# EAGLE design g030f6 (EAGLE 9.6.2)
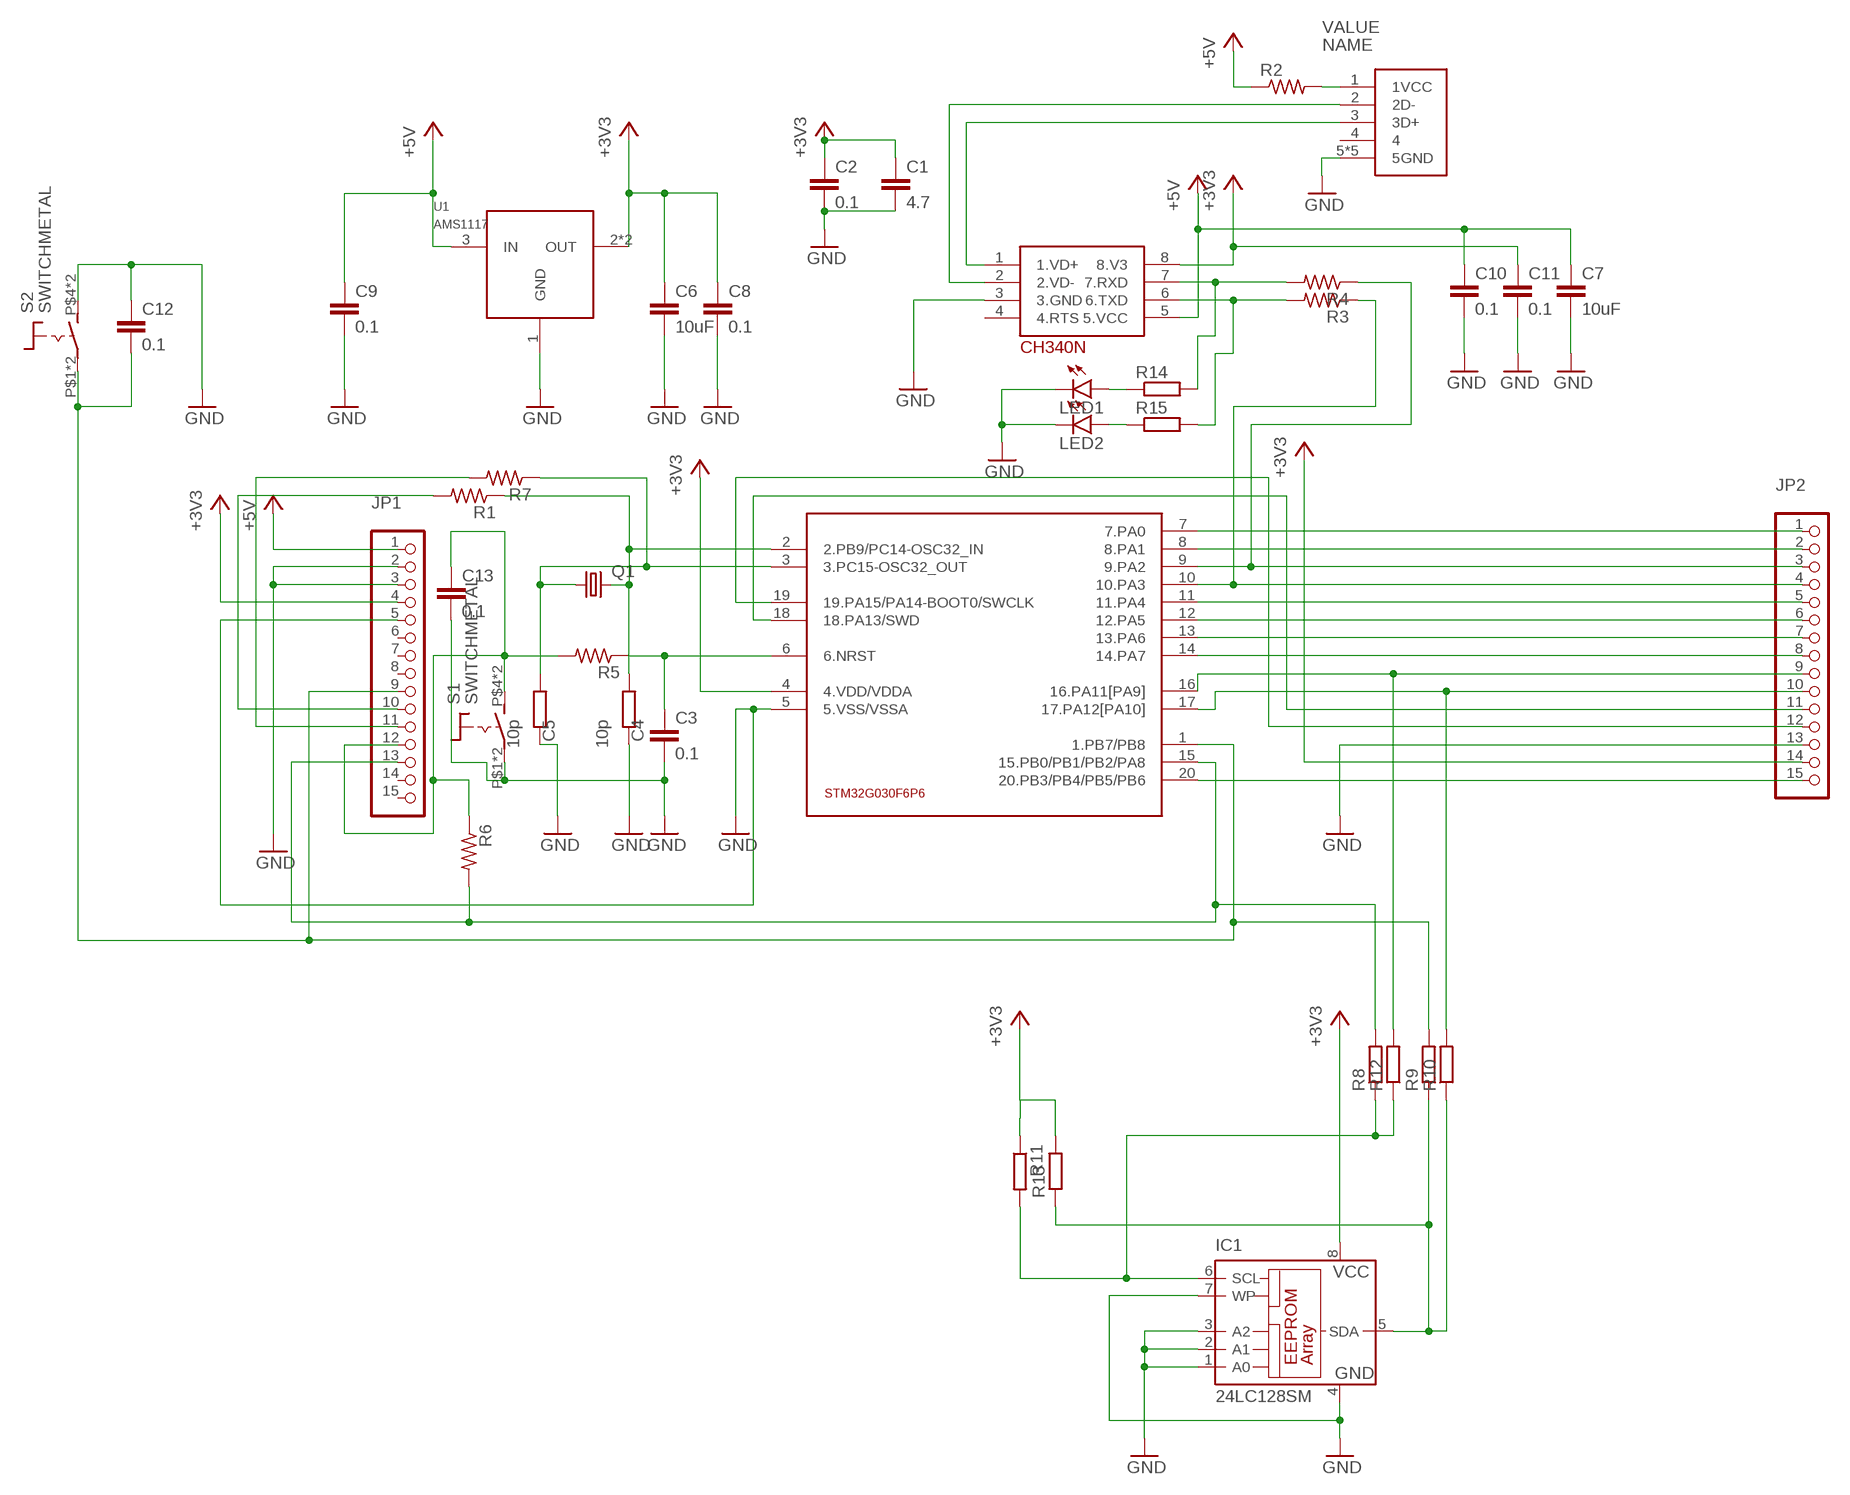
[diagram p0: schematic, sheet 1]

## Parts
C1  4.7  C-EUC0805  [C0805]
C2  0.1  C-EUC0402  [C0402]
C3  0.1  C-EUC0402  [C0402]
C4  10p  R-EU_R0402  [R0402]
C5  10p  R-EU_R0402  [R0402]
C6  10uF  C-EUC0805  [C0805]
C7  10uF  C-EUC0805  [C0805]
C8  0.1  C-EUC0402  [C0402]
C9  0.1  C-EUC0402  [C0402]
C10  0.1  C-EUC0402  [C0402]
C11  0.1  C-EUC0402  [C0402]
C12  0.1  C-EUC0402  [C0402]
C13  0.1  C-EUC0402  [C0402]
CONN1  MICROUSB  [MICROUSB5]
IC1  24LC128SM  [SO-08M]
JP1  PINHD-1X15  [1X15]
JP2  PINHD-1X15  [1X15]
LED1  LEDSML0603  [SML0603]
LED2  LEDSML0603  [SML0603]
Q1  CRYSTALTC26V  [TC26V]
R1  R-US_R0402  [R0402]
R2  R-US_R2010  [R2010]
R3  R-US_R0402  [R0402]
R4  R-US_R0402  [R0402]
R5  R-US_R0402  [R0402]
R6  R-US_R0402  [R0402]
R7  R-US_R0402  [R0402]
R8  R-EU_R0603  [R0603]
R9  R-EU_R0603  [R0603]
R10  R-EU_R0603  [R0603]
R11  R-EU_R0603  [R0603]
R12  R-EU_R0603  [R0603]
R13  R-EU_R0603  [R0603]
R14  R-EU_R0402  [R0402]
R15  R-EU_R0402  [R0402]
S1  SWITCHMETAL  [SWMET]
S2  SWITCHMETAL  [SWMET]
U1  AMS1117  [SOT223]
U$1  STM32GO3OF6P6  [TSSOP20]
U$3  CH340N  [SO-8]

## Nets
+3V3: C1.1 C2.1 C6.1 C8.1 C11.1 IC1.8(VCC) JP1.4 JP2.14 R11.1 R13.2 U1.2(OUT) U1.4(OUT) U$1.4(4.VDD/VDDA) U$3.8(8.V3)
+5V: C7.1 C9.1 C10.1 JP1.1 R2.1 U1.3(IN) U$3.5(5.VCC)
GND: C1.2 C2.2 C3.2 C4.2 C5.2 C6.2 C7.2 C8.2 C9.2 C10.2 C11.2 C12.1 C13.2 CONN1.5(5GND) CONN1.P$1(5GND) CONN1.P$2(5GND) CONN1.P$6(5GND) CONN1.P$7(5GND) IC1.1(A0) IC1.2(A1) IC1.3(A2) IC1.4(GND) IC1.7(WP) JP1.2 JP1.3 JP1.5 JP2.13 LED1.C LED2.C S1.P$1(P) S1.P$1@1(P) S2.P$4(S) S2.P$4@1(S) U1.1(GND) U$1.5(5.VSS/VSSA) U$3.3(3.GND)
N$1: C4.1 Q1.2 R1.1 U$1.2(2.PB9/PC14-OSC32_IN)
N$2: C5.1 Q1.1 R7.1 U$1.3(3.PC15-OSC32_OUT)
N$3: JP1.13 R6.2 R8.2 U$1.15(15.PB0/PB1/PB2/PA8)
N$4: C13.1 JP1.12 R5.2 R6.1 S1.P$4(S) S1.P$4@1(S)
N$5: JP2.11 U$1.18(18.PA13/SWD)
N$6: JP2.12 U$1.19(19.PA15/PA14-BOOT0/SWCLK)
N$7: C3.1 R5.1 U$1.6(6.NRST)
N$8: IC1.6(SCL) R8.1 R11.2 R12.1
N$9: JP2.4 R3.1 U$1.10(10.PA3)
N$10: JP2.3 R4.1 U$1.9(9.PA2)
N$11: LED1.A R14.1
N$12: LED2.A R15.1
N$13: JP2.5 U$1.11(11.PA4)
N$14: JP2.6 U$1.12(12.PA5)
N$15: JP2.7 U$1.13(13.PA6)
N$16: JP2.8 U$1.14(14.PA7)
N$17: JP2.9 R12.2 U$1.16(16.PA11[PA9])
N$18: JP2.10 R10.2 U$1.17(17.PA12[PA10])
N$19: CONN1.1(1VCC) R2.2
N$20: JP1.11 R7.2
N$21: JP2.15 U$1.20(20.PB3/PB4/PB5/PB6)
N$22: CONN1.2(2D-) U$3.2(2.VD-)
N$23: CONN1.3(3D+) U$3.1(1.VD+)
N$24: JP2.1 U$1.7(7.PA0)
N$25: R3.2 R15.2 U$3.6(6.TXD)
N$26: R4.2 R14.2 U$3.7(7.RXD)
N$27: JP2.2 U$1.8(8.PA1)
N$29: JP1.10 R1.2
N$30: C12.2 JP1.9 R9.2 S2.P$1(P) S2.P$1@1(P) U$1.1(1.PB7/PB8)
N$36: IC1.5(SDA) R9.1 R10.1 R13.1
Unconnected: CONN1.4 JP1.6 JP1.7 JP1.8 JP1.14 JP1.15 U$3.4(4.RTS)

## Library data of the parts
C1-C3 C6-C13 = rcl:C-EU: CAPACITOR, European symbol; SPICEPREFIX: C
C4 C5 R8-R15 = rcl:R-EU_: RESISTOR, European symbol; SPICEPREFIX: R
CONN1 = microusb:MICROUSB
IC1 = microchip:24*: Serial EEPROM I2C; MF: MICROCHIP; MPN: 24LC128-I/SM; OC_FARNELL: 9757937; OC_NEWARK: 92C7134
JP1 JP2 = pinhead:PINHD-1X15: PIN HEADER
LED1 LED2 = led:LED: LED OSRAM: - CHIPLED LG R971, LG N971, LY N971, LG Q971, LY Q971, LO R971, LY R971 LH N974, LH R974 LS Q976, LO Q976, LY Q976 LO Q996 - Hyper CHIPLED LW Q18S LB Q993, LB Q99A, LB R99A - SideLED LS A670, LO A670, LY A670, LG A670, LP A670 LB A673, LV A673, LT A673, LW A673 LH A674 LY A675 LS A676, LA A676, LO A676, LY A676, LW A676 LS A679, LY A679, LG A679 - Hyper Micro SIDELED® LS Y876, LA Y876, LO Y876, LY Y876 LT Y87S - SmartLED LW L88C, LW L88S LB L89C, LB L89S, LG L890 LS L89K, LO L89K, LY L89K LS L896, LA L896, LO L896, LY L896 - TOPLED LS T670, LO T670, LY T670, LG T670, LP T670 LSG T670, LSP T670, LSY T670, LOP T670, LYG T670 LG T671, LOG T671, LSG T671 LB T673, LV T673, LT T673, LW T673 LH T674 LS T676, LA T676, LO T676, LY T676, LB T676, LH T676, LSB T676, LW T676 LB T67C, LV T67C, LT T67C, LS T67K, LO T67K, LY T67K, LW E67C LS E67B, LA E67B, LO E67B, LY E67B, LB E67C, LV E67C, LT E67C LW T67C LS T679, LY T679, LG T679 LS T770, LO T770, LY T770, LG T770, LP T770 LB T773, LV T773, LT T773, LW T773 LH T774 LS E675, LA E675, LY E675, LS T675 LS T776, LA T776, LO T776, LY T776, LB T776 LHGB T686 LT T68C, LB T68C - Hyper Mini TOPLED® LB M676 - Mini TOPLED Santana® LG M470 LS M47K, LO M47K, LY M47K Source: http://www.osram.convergy.de LUXEON: - LUMILED® LXK2-PW12-R00, LXK2-PW12-S00, LXK2-PW14-U00, LXK2-PW14-V00 LXK2-PM12-R00, LXK2-PM12-S00, LXK2-PM14-U00 LXK2-PE12-Q00, LXK2-PE12-R00, LXK2-PE12-S00, LXK2-PE14-T00, LXK2-PE14-U00 LXK2-PB12-K00, LXK2-PB12-L00, LXK2-PB12-M00, LXK2-PB14-N00, LXK2-PB14-P00, LXK2-PB14-Q00 LXK2-PR12-L00, LXK2-PR12-M00, LXK2-PR14-Q00, LXK2-PR14-R00 LXK2-PD12-Q00, LXK2-PD12-R00, LXK2-PD12-S00 LXK2-PH12-R00, LXK2-PH12-S00 LXK2-PL12-P00, LXK2-PL12-Q00, LXK2-PL12-R00 Source: www.luxeon.com KINGBRIGHT: KA-3528ASYC Source: www.kingbright.com
Q1 = crystal:CRYSTAL: CRYSTAL; OC_FARNELL: unknown; OC_NEWARK: unknown
R1-R7 = rcl:R-US_: RESISTOR, American symbol; SPICEPREFIX: R
S1 S2 = switchmetal:SWITCHMETAL
U1 = AMS1117:AMS1117
U$1 = stm32g030f6p6:STM32GO3OF6P6
U$3 = ch340n:CH340N

## Board
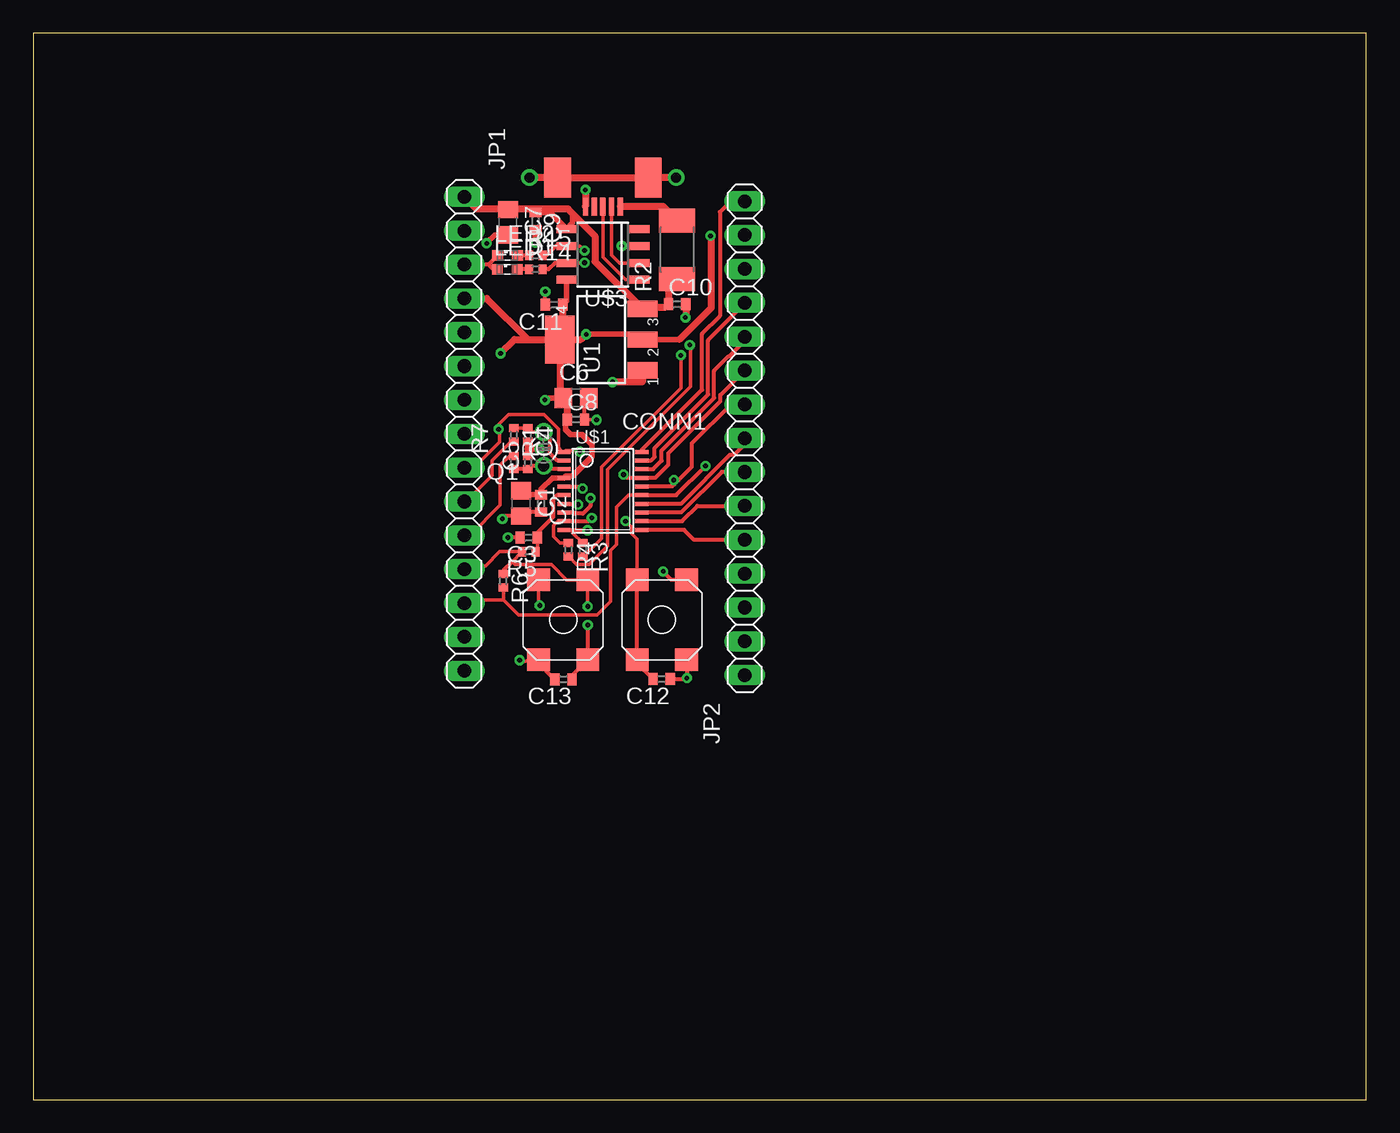
[diagram p1: board, top side]
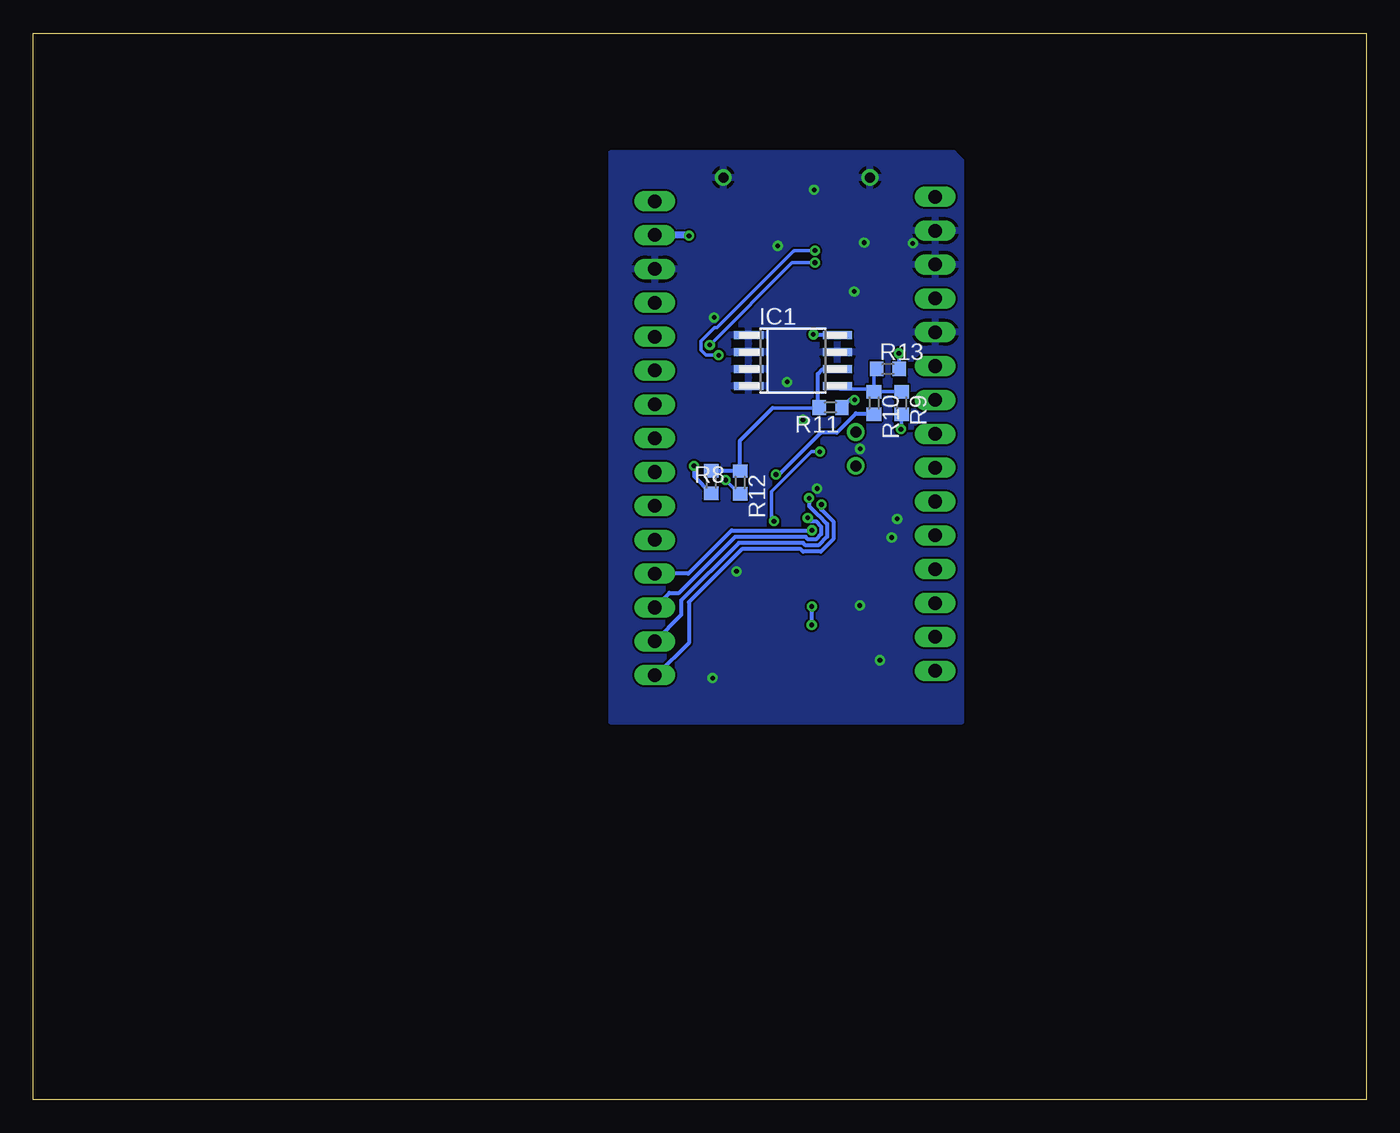
[diagram p2: board, bottom side, seen from below]

Size 100 x 80 mm. Coordinates in mm from the lower left corner, seen from the top.
Outline: 0,0 100,0 100,80 0,80 0,0
Copper layers (1*16): Top 0.035mm / dielectric 1.5mm / Bottom 0.035mm
Design rules "default": minimum track width 6mil, minimum drill 0.35mm, track to track 6mil, track to pad 6mil, pad to pad 6mil, via to via 6mil, smd to smd 6mil, copper to edge 40mil, drill to drill 6mil, minimum pad ring 10mil, minimum via ring 8mil, stop-mask expansion 4mil, vias tented up to drill 0mil, thermal gap 10mil

### Footprints (pad centres in the part's own frame; a part is rotated, then mirrored left to right if it is on the bottom)
C0805 = smd 1.3 x 1.5: 1 -0.95,0; 2 0.95,0
C0402 = smd 0.7 x 0.9: 1 -0.65,0; 2 0.65,0
R0402 = smd 0.6 x 0.7: 1 -0.5,0; 2 0.5,0
MICROUSB5 = smd 0.4 x 1.35: 1 -1.3,2.675; 2 -0.65,2.675; 3 0,2.675; 4 0.65,2.675; 5 1.3,2.675 | drill 0.75: P$1 -5.5,0.5; P$2 5.5,0.5 | smd 2 x 3: P$6 -3.4,0.5; P$7 3.4,0.5
SO-08M = smd 0.6 x 2.2: 1 -1.905,-3.33; 2 -0.635,-3.33; 3 0.635,-3.33; 4 1.905,-3.33; 5 1.905,3.33; 6 0.635,3.33; 7 -0.635,3.33; 8 -1.905,3.33
1X15 = drill 1.016 long: 1 -17.78,0; 2 -15.24,0; 3 -12.7,0; 4 -10.16,0; 5 -7.62,0; 6 -5.08,0; 7 -2.54,0; 8 0,0; 9 2.54,0; 10 5.08,0; 11 7.62,0; 12 10.16,0; 13 12.7,0; 14 15.24,0; 15 17.78,0
SML0603 = smd 0.8 x 0.8: A 0.75,0; C -0.75,0
TC26V = drill 0.813: 1 -1.27,0; 2 1.27,0
R2010 = smd 1.8 x 2.7: 1 -2.2,0; 2 2.2,0
R0603 = smd 1 x 1.1: 1 -0.85,0; 2 0.85,0
SWMET = smd 1.7 x 1.7: P$1 -3,1.85; P$1@1 3,1.85; P$4 -3,-1.85; P$4@1 3,-1.85
SOT223 = smd 1.219 x 2.235: 1 -2.311,-3.099; 2 0,-3.099; 3 2.311,-3.099 | smd 3.6 x 2.2: 4 0,3.099
TSSOP20 = smd 0.305 x 0.991: 1 -2.925,-2.918; 2 -2.275,-2.918; 3 -1.625,-2.918; 4 -0.975,-2.918; 5 -0.325,-2.918; 6 0.325,-2.918; 7 0.975,-2.918; 8 1.625,-2.918; 9 2.275,-2.918; 10 2.925,-2.918; 11 2.925,2.918; 12 2.275,2.918; 13 1.625,2.918; 14 0.975,2.918; 15 0.325,2.918; 16 -0.325,2.918; 17 -0.975,2.918; 18 -1.625,2.918; 19 -2.275,2.918; 20 -2.925,2.918
SO-8 = smd 0.6 x 1.52: 1 -1.905,-2.725; 2 -0.635,-2.725; 3 0.635,-2.725; 4 1.905,-2.725; 5 1.905,2.725; 6 0.635,2.725; 7 -0.635,2.725; 8 -1.905,2.725

### Placement (x,y rotation side)
C1  36.59,44.73 270 top
C2  38.11,44.73 270 top
C3  37.17,42.16 180 top
C4  37.1,49.87 270 top
C5  37.11,47.8 90 top
C6  40.72,52.65 0 top
C7  35.61,65.82 270 top
C8  40.71,51.03 0 top
C9  37.67,65.91 270 top
C10  48.31,59.67 0 top
C11  39.07,59.63 180 top
C12  47.14,31.54 180 top
C13  39.77,31.53 180 top
CONN1  42.73,69.68 180 top
IC1  43,55.44 270 bottom
JP1  32.33,49.95 270 top
JP2  53.37,49.62 90 top
LED1  35.56,62.3 0 top
LED2  35.58,63.33 0 top
Q1  38.29,48.81 90 top
R1  36.05,49.87 270 top
R2  48.31,63.76 90 top
R3  41.23,41.24 270 top
R4  40.14,41.24 270 top
R5  37.17,41.11 180 top
R6  35.25,38.92 270 top
R7  36.05,47.8 90 top
R8  49.14,46.33 270 bottom
R9  34.86,52.26 270 bottom
R10  36.93,52.26 270 bottom
R11  40.18,51.92 180 bottom
R12  46.97,46.31 270 bottom
R13  35.88,54.82 0 bottom
R14  37.69,62.3 0 top
R15  37.69,63.33 0 top
S1  39.76,36 90 top
S2  47.15,36 90 top
U1  42.6,57.02 90 top
U$1  42.73,45.67 270 top
U$3  42.73,63.41 90 top

### Tracks (layer width: path | path; a pad name or v marks a point on that pad's centre or on a via)
+3V3  (via drill 0.35)
  Top 0.406: C8.1 39.95,50.92 39.95,50.25 40.31,49.89 41.17,49.89 41.92,49.14 41.92,48.26 40.45,46.79 39.95,46.79 U$1.4 38.97,46.65 38.11,45.79 C2.1 36.89,45.38 C1.1 | 48.47,57.02 U1.2 45.29,57.43 41.5,57.43 v41.48,57.41 | U$3.8 40.01,59.91 C11.1 | v38.38,52.49 38.54,52.65 C6.1
  Top 0.508: v50.81,64.81 50.87,64.75 50.87,59.41 48.47,57.02 | C8.1 40.06,52.36 C6.1 39.5,52.92 U1.4 | JP1.4 34.02,60.11 37.11,57.02 U1.4 | C11.1 39.72,57.24 U1.4 | v41.48,57.41 41.09,57.02 U1.4 | v35.06,55.99 36.09,57.02 U1.4
  Bottom 0.305: v41.48,57.41 41.41,57.34 IC1.8 | v35.06,55.99 35.06,54.85 R13.2 | R11.1 38.76,52.49 v38.38,52.49
  Bottom 0.508: v50.81,64.81 50.86,64.86 JP2.14
+5V
  Top 0.406: 40.47,66.47 40.47,65.78 U$3.5 38.76,66.56 C9.1 37.37,66.86 35.7,66.86 C7.1
  Top 0.508: JP1.1 33.25,66.81 40.12,66.81 40.47,66.47 42.14,64.79 42.14,62.88 U1.3 45.8,59.43 47.42,59.43 C10.1 47.66,59.92 47.67,59.93 47.67,60.92 R2.1
GND  (via drill 0.35)
  Top 0.254: S1.P$1 37.79,33 37.26,33 36.6,32.79 v36.48,32.96 | v37.99,37.07 37.91,37.15 S1.P$1@1 | C8.2 42.23,51.03 v42.26,51
  Top 0.305: C2.2 36.89,44.08 C1.2 35.4,43.78 v35.19,43.57 | U$1.5 41.05,45.99 v41.2,45.85 | C3.2 v35.61,42.16 v35.6,42.17 | C8.2 41.36,52.34 C6.2 | C11.2 v38.41,60.63 | LED2.C 34.15,62.65 | 34.15,62.65 JP1.3 | LED1.C 34.5,62.3 34.15,62.65 | S2.P$4 49.03,32.97 v49.03,31.62 48.95,31.54 C12.1 | S2.P$4@1 47.88,39 v47.25,39.63 | C13.2 37.79,32.86 37.79,33
  Top 0.406: U$3.3 v44.16,64.05 v44.15,64.05 | C9.2 v37.66,64.29 | C7.2 34.6,64.87 34.02,64.29 v34.02,64.25
  Top 0.508: CONN1.P$2 CONN1.P$7 CONN1.P$6 CONN1.P$1 | U1.1 45.7,53.84 v43.45,53.84 | CONN1.5 v41.42,68.26 | C10.2 48.96,58.72 v48.92,58.68 | C4.2 37.11,48.84 | 37.11,48.84 C5.2 | v37.97,48.83 37.12,48.83 37.11,48.84
  pour Bottom: 30.96,70.97 56.63,70.97 56.63,28.39 30.39,28.39 30.39,70.4
N$1
  Top 0.254: Q1.2 37.39,50.08 C4.1 R1.1
  Top 0.305: U$1.2 39.3,47.95 38.74,48.5 38.74,49.63 Q1.2
N$2
  Top 0.305: U$1.3 38.53,47.3 Q1.1 37.35,47.54 C5.1 R7.1
N$3  (via drill 0.35)
  Top 0.254: U$1.15 44.66,45.34 43.77,44.46 43.77,41.66 43.3,41.19 43.3,37.36 42.28,36.34 36.41,36.34 35.28,37.47 | 35.28,37.47 32.55,37.47 JP1.13 | R6.2 35.28,38.39 35.28,37.47
  Top 0.305: U$1.15 48.23,45.34 v50.43,47.54
  Bottom 0.305: v50.43,47.54 50.43,46.77 R8.2
N$4  (via drill 0.35)
  Top 0.254: JP1.12 32.58,40.04 33.92,40.04 34.99,41.11 R5.2 35.91,40.35 36.13,40.13 38.88,40.13 40.01,39 S1.P$4@1 41.59,38.98 v41.59,37
  Top 0.305: C13.1 40.42,31.81 S1.P$4 v41.61,35.6 v41.6,35.61 | 35.91,40.35 35.25,39.69 R6.1
  Bottom 0.305: v41.6,35.61 41.6,36.99 v41.59,37
N$5
  Top 0.305: U$1.18 46.49,47.3 47.14,47.94 47.14,48.7 51.08,52.65 51.08,54.69 52.17,55.77 52.24,55.77 53.37,56.9 JP2.11
N$6
  Top 0.305: U$1.19 46.35,47.95 46.62,48.22 46.62,48.9 50.63,52.91 50.63,56.98 53.37,59.72 JP2.12
N$7
  Top 0.254: R5.1 37.82,41.11 C3.1
  Top 0.305: U$1.6 39.27,45.34 39.01,45.08 39.01,43.72 37.82,42.54 C3.1
N$8
  Bottom 0.254: 40.78,54.8 IC1.6
  Bottom 0.305: R8.1 46.99,47.18 R12.1 46.97,49.45 44.53,51.89 R11.2 41.15,52.32 41.15,54.44 40.78,54.8
N$9  (via drill 0.35)
  Top 0.254: R3.1 40.47,42.5 40.47,42.74
  Top 0.305: U$1.10 40.47,42.74 41.58,42.74 v41.58,42.71
  Bottom 0.305: JP2.4 50.86,39.46 47.61,42.71 v41.58,42.71
N$10  (via drill 0.35)
  Top 0.254: R4.1 39.53,41.74 39.03,42.24 39.03,43.07 39.36,43.4 U$1.9
  Top 0.305: U$1.9 41.66,43.4 v41.9,43.64
  Bottom 0.305: v41.9,43.64 41.65,43.39 41.3,43.39 40.9,42.99 40.9,42.43 41.3,42.03 41.86,42.03 42.06,42.22 47.34,42.22 51.54,38.02 52.27,38.02 JP2.3
N$11
  Top 0.305: R14.1 LED1.A
N$12
  Top 0.305: R15.1 LED2.A
N$13
  Top 0.305: JP2.5 49.57,42 48.83,42.74 U$1.11
N$14
  Top 0.305: U$1.12 48.69,43.4 49.83,44.54 JP2.6
N$15
  Top 0.305: JP2.7 53.35,47.1 51.65,47.1 48.59,44.05 U$1.13
N$16
  Top 0.305: JP2.8 53.37,49.15 52.61,48.39 52.28,48.39 48.59,44.7 U$1.14
N$17  (via drill 0.35)
  Top 0.305: 47.93,45.99 49.39,47.46 49.39,49.22 52.33,52.16 JP2.9 | 47.93,45.99 U$1.16 | v48.06,46.48 47.93,46.35 47.93,45.99
  Bottom 0.254: v48.06,46.48 47.04,45.46 R12.2
N$18  (via drill 0.35)
  Top 0.305: JP2.10 51.54,52.87 51.54,52.39 47.64,48.49 47.64,47.64 46.65,46.65 U$1.17 44.52,46.65 v44.28,46.89
  Bottom 0.305: R10.2 36.99,51.47 38.29,51.47 39.72,50.04 40.9,50.04 44.05,46.89 v44.28,46.89
N$19
  Top 0.508: CONN1.1 47.27,67 R2.2
N$20
  Top 0.254: R7.2 35.74,48.3 35.03,47.59 35.03,44.59 32.77,42.33 JP1.11
N$21
  Top 0.305: U$1.20 45.65,48.73 50.17,53.26 50.17,57.46 51.51,58.8 51.51,66.59 52.32,67.4 JP2.15
N$22
  Top 0.254: CONN1.2 43.38,63.36 43.97,62.77 U$3.2
N$23
  Top 0.254: U$3.1 44.45,61.51 42.73,63.22 CONN1.3
N$24  (via drill 0.35)
  Top 0.305: U$1.7 40.83,44.7 v40.87,44.65
  Bottom 0.305: v40.87,44.65 40.87,44.26 39.98,43.37 39.98,42.05 40.92,41.11 42.24,41.11 42.44,41.31 46.84,41.31 50.82,37.32 50.82,34.25 53.23,31.84 JP2.1
N$25  (via drill 0.35)
  Top 0.254: R3.2 41.65,41.16 41.7,41.16 42.65,42.11 42.65,47.44 48.6,53.4 48.6,55.83 v48.58,55.85 | v41.35,63.7 41,64.05 U$3.6
  Top 0.305: U$3.6 39.19,64.05 38.47,63.33 R15.2
  Bottom 0.254: v48.58,55.85 49.55,55.85 49.92,56.22 49.92,56.9 48.9,57.92 48.69,57.92 42.91,63.7 v41.35,63.7
N$26  (via drill 0.35)
  Top 0.254: R4.2 40.19,40.74 40.76,40.16 41.7,40.16 43.08,41.55 43.08,47.27 49.31,53.5 49.31,56.55 v49.25,56.62 | v41.35,62.79 41.34,62.77 U$3.7
  Top 0.305: U$3.7 39.12,62.77 38.65,62.3 R14.2
  Bottom 0.254: v49.25,56.62 43.08,62.79 v41.35,62.79
N$27  (via drill 0.35)
  Top 0.305: U$1.8 40.51,44.05 40.59,43.97 41.23,43.97 41.8,44.54 v41.8,45.12
  Bottom 0.305: JP2.2 51.39,36.36 51.39,37.44 47.07,41.76 42.24,41.76 42.05,41.57 41.11,41.57 40.44,42.24 40.44,43.18 41.11,43.85 41.12,43.85 41.8,44.53 v41.8,45.12
N$29
  Top 0.254: R1.2 35.84,49.37 34.42,47.96 34.42,46.81 32.48,44.87 JP1.10
N$30  (via drill 0.35)
  Top 0.254: 39.39,49.1 39.39,50.32 38.33,51.38 35.65,51.38 34.91,50.64 v34.91,50.3 34.98,50.23 34.98,49.32 33.07,47.41 JP1.9 | U$1.1 39.92,48.7 40.9,48.7 v40.99,48.61 | v44.43,43.39 44.87,42.95 44.87,42.48 45.3,42.05 S2.P$1@1
  Top 0.305: U$1.1 39.68,48.59 39.39,48.89 39.39,49.1 | C12.2 45.3,32.73 S2.P$1 S2.P$1@1
  Bottom 0.254: v40.99,48.61 41.61,48.61 44.61,45.61 44.61,43.57 v44.43,43.39 | v34.91,50.3 34.86,50.35 R9.2
N$36
  Bottom 0.254: R9.1 R10.1 | R13.1 36.93,54.62 R10.1 | IC1.5 39.45,53.31 37.13,53.31 R10.1